# EAGLE design MainBoardR6 (EAGLE 6.5.0)
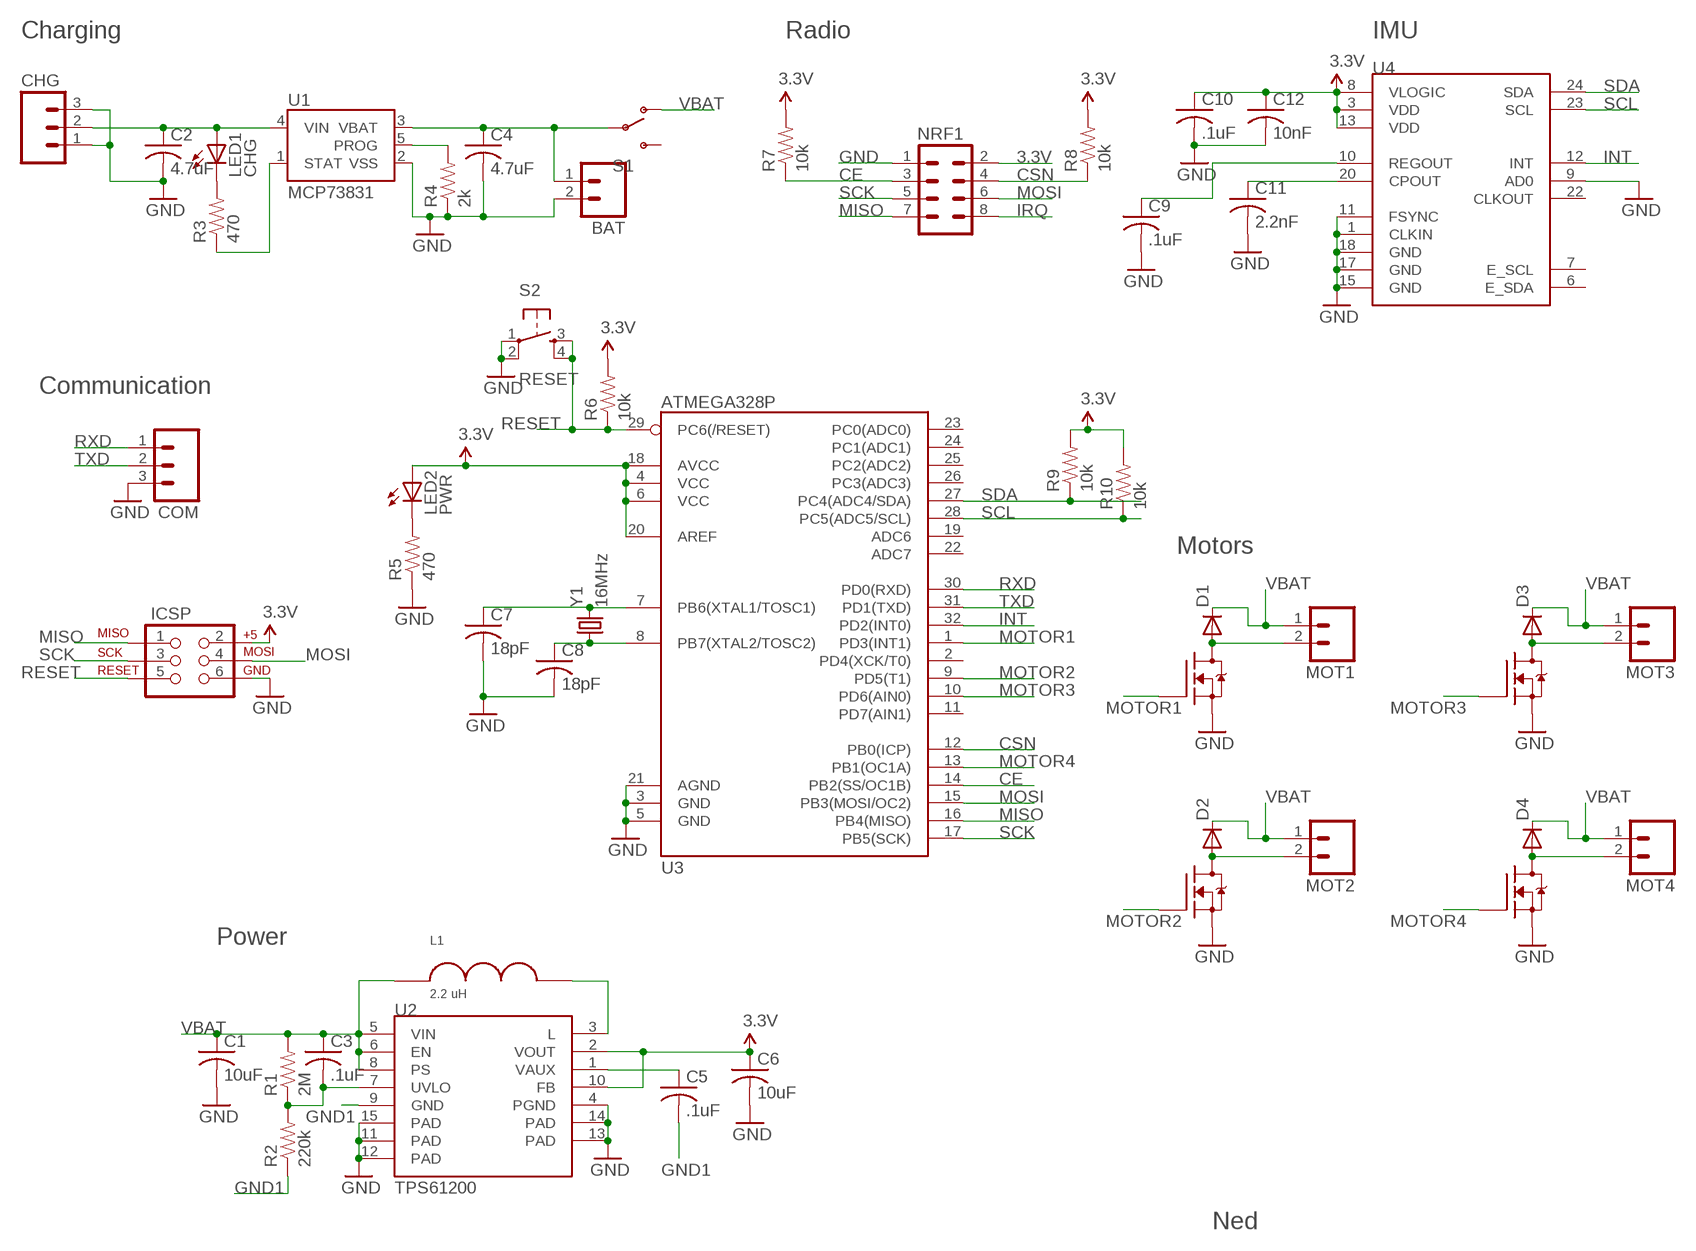
[diagram p0: schematic, sheet 1]

## Parts
BAT  M02LOCK_LONGPADS  [1X02_LOCK_LONGPADS]
C1  10uF  C-USC0805  [C0805]
C2  4.7uF  C-USC0805  [C0805]
C3  .1uF  C-USC0805  [C0805]
C4  4.7uF  C-USC0805  [C0805]
C5  .1uF  C-USC0805  [C0805]
C6  10uF  C-USC0805  [C0805]
C7  18pF  C-USC0805  [C0805]
C8  18pF  C-USC0805  [C0805]
C9  .1uF  C-USC0805  [C0805]
C10  .1uF  C-USC0805  [C0805]
C11  2.2nF  C-USC0805  [C0805]
C12  10nF  C-USC0805  [C0805]
CHG  M03LONGPADS  [1X03_LONGPADS]
COM  M03LONGPADS  [1X03_LONGPADS]
D1  BAS16-V-GS18  [SOT23]
D2  BAS16-V-GS18  [SOT23]
D3  BAS16-V-GS18  [SOT23]
D4  BAS16-V-GS18  [SOT23]
ICSP  AVR_SPI_PRG_62X3_LOCK  [2X3_LOCK]
L1  2.2 uH  BRHL2518T2R2M  [2518]
LED1  CHG  LED1206  [LED-1206]
LED2  PWR  LED1206  [LED-1206]
MOT1  M02LOCK_LONGPADS  [1X02_LOCK_LONGPADS]
MOT2  M02LOCK_LONGPADS  [1X02_LOCK_LONGPADS]
MOT3  M02LOCK_LONGPADS  [1X02_LOCK_LONGPADS]
MOT4  M02LOCK_LONGPADS  [1X02_LOCK_LONGPADS]
NRF1  M04X2  [2X4]
R1  2M  RESISTOR0805-RES  [0805]
R2  220k  RESISTOR0805-RES  [0805]
R3  470  RESISTOR0805-RES  [0805]
R4  2k  RESISTOR0805-RES  [0805]
R5  470  RESISTOR0805-RES  [0805]
R6  10k  RESISTOR0805-RES  [0805]
R7  10k  RESISTOR0805-RES  [0805]
R8  10k  RESISTOR0805-RES  [0805]
R9  10k  RESISTOR0805-RES  [0805]
R10  10k  RESISTOR0805-RES  [0805]
S1  SWITCH-SPST-SMD-A  [SWITCH-SPST-SMD-A]
S2  RESET  TAC_SWITCHSMD  [TACTILE_SWITCH_SMD]
T1  SI1902CDL  [SOT363_INFINEON]
T2  SI1902CDL  [SOT363_INFINEON]
U1  MCP73831  [SOT23-5]
U2  TPS61200  [QFN-10_PAD]
U3  ATMEGA328P  ATMEGA328_SMT  [TQFP32-08]
U4  MPU-9150QFN-24-NP  [QFN-24-NP]
Y1  16MHz  CRYSTAL5X3  [CRYSTAL-SMD-5X3]

## Nets
3.3V: C6.1 C10.1 C12.1 ICSP.2 LED2.A NRF1.2 R6.2 R7.2 R8.2 R9.2 R10.2 U2.2(VOUT) U2.10(FB) U3.4(VCC) U3.6(VCC) U3.18(AVCC) U3.20(AREF) U4.3(VDD) U4.8(VLOGIC) U4.13(VDD)
BAT+: BAT.1 C4.1 S1.2(P) U1.3(VBAT)
CE: NRF1.3 R7.1 U3.14(PB2(SS/OC1B))
CSN: NRF1.4 R8.1 U3.12(PB0(ICP))
GND: BAT.2 C1.2 C2.2 C4.2 C6.2 C7.2 C8.2 C9.2 C10.2 C11.2 C12.2 CHG.1 CHG.3 COM.3 ICSP.6 NRF1.1 R4.1 R5.1 S2.1 S2.2 T1.1(S) T1.4(S) T2.1(S) T2.4(S) U1.2(VSS) U2.4(PGND) U2.11(PAD) U2.12(PAD) U2.13(PAD) U2.14(PAD) U2.15(PAD) U3.3(GND) U3.5(GND) U3.21(AGND) U4.1(CLKIN) U4.9(AD0) U4.11(FSYNC) U4.15(GND) U4.17(GND) U4.18(GND)
GND1: C5.2 R2.1 U2.9(GND)
INT: U3.32(PD2(INT0)) U4.12(INT)
IRQ: NRF1.8
MISO: ICSP.1 NRF1.7 U3.16(PB4(MISO))
MOSI: ICSP.4 NRF1.6 U3.15(PB3(MOSI/OC2))
MOT1-: D1.1(A) MOT1.2 T1.6(D)
MOT2-: D2.1(A) MOT2.2 T1.3(D)
MOT3-: D3.1(A) MOT3.2 T2.6(D)
MOT4-: D4.1(A) MOT4.2 T2.3(D)
MOTOR1: T1.2(G) U3.1(PD3(INT1))
MOTOR2: T1.5(G) U3.9(PD5(T1))
MOTOR3: T2.2(G) U3.10(PD6(AIN0))
MOTOR4: T2.5(G) U3.13(PB1(OC1A))
N$2: C7.1 U3.7(PB6(XTAL1/TOSC1)) Y1.3
N$3: C8.1 U3.8(PB7(XTAL2/TOSC2)) Y1.1
N$4: C11.1 U4.20(CPOUT)
N$5: LED1.C R3.2
N$9: C9.1 U4.10(REGOUT)
N$10: R3.1 U1.1(STAT)
N$12: R4.2 U1.5(PROG)
N$13: C5.1 U2.1(VAUX)
N$14: C3.2 R1.1 R2.2 U2.7(UVLO)
N$15: LED2.C R5.2
N$16: L1.P$2 U2.3(L)
RESET: ICSP.5 R6.1 S2.3 S2.4 U3.29(PC6(/RESET))
RXD: COM.1 U3.30(PD0(RXD))
SCK: ICSP.3 NRF1.5 U3.17(PB5(SCK))
SCL: R10.1 U3.28(PC5(ADC5/SCL)) U4.23(SCL)
SDA: R9.1 U3.27(PC4(ADC4/SDA)) U4.24(SDA)
TXD: COM.2 U3.31(PD1(TXD))
VBAT: C1.1 C3.1 D1.3(C) D2.3(C) D3.3(C) D4.3(C) L1.P$1 MOT1.1 MOT2.1 MOT3.1 MOT4.1 R1.2 S1.1(O) U2.5(VIN) U2.6(EN) U2.8(PS)
VIN: C2.1 CHG.2 LED1.A U1.4(VIN)
Unconnected: S1.3(S) U3.2(PD4(XCK/T0)) U3.11(PD7(AIN1)) U3.19(ADC6) U3.22(ADC7) U3.23(PC0(ADC0)) U3.24(PC1(ADC1)) U3.25(PC2(ADC2)) U3.26(PC3(ADC3)) U4.6(E_SDA) U4.7(E_SCL) U4.22(CLKOUT)

## Notes on the sheet
- Charging | Radio | IMU
- Communication
- Motors
- Power
- Ned

## Library data of the parts
BAT MOT1-MOT4 = SparkFun:M02: Header 2 Standard 2-pin 0.1" header. Use with straight break away headers (SKU : PRT-00116), right angle break away headers (PRT-00553), swiss pins (PRT-00743), machine pins (PRT-00117), and female headers (PRT-00115). Molex polarized connector foot print use with SKU : PRT-08233 with associated crimp pins and housings.
C1-C12 = rcl:C-US: CAPACITOR, American symbol
CHG COM = SparkFun:M03: Header 3 Standard 3-pin 0.1" header. Use with straight break away headers (SKU : PRT-00116), right angle break away headers (PRT-00553), swiss pins (PRT-00743), machine pins (PRT-00117), and female headers (PRT-00115). Molex polarized connector foot print use with SKU : PRT-08232 with associated crimp pins and housings.
D1-D4 = diode:BAS16-V-GS18
ICSP = SparkFun:AVR_SPI_PRG_6: AVR ISP 6 Pin This is the reduced ISP connector for AVR programming. Common on Arduino. This footprint will take up less PCB space and can be used with a 10-pin to 6-pin adapter such as SKU: BOB-08508
L1 = inductors:BRHL2518T2R2M
LED1 LED2 = SparkFun:LED: LEDs Standard schematic elements and footprints for 5mm, 3mm, 1206, and 0603 sized LEDs. 5mm - Spark Fun Electronics SKU : COM-00529 (and others)
NRF1 = SparkFun:M04X2
R1-R10 = SparkFun:RESISTOR: Resistor Basic schematic elements and footprints for 0603, 1206, and PTH resistors.
S1 = SparkFun:SWITCH-SPST: SPST Switch Simple slide switch. Spark Fun Electronics SKU : COM-00102
S2 = SparkFun:TAC_SWITCH: Momentary Switch Button commonly used for reset or general input. Spark Fun Electronics SKU : COM-00097
T1 T2 = transistor-fet:SI1902CDL
U1 = SparkFun:MCP73831: Microchip's MCP73831 Miniature single cell, fully integrated Li-Ion, Li-polymer charge management controller http://ww1.microchip.com/downloads/en/DeviceDoc/21984a.pdf
U2 = SparkFun:TPS61200: DC to DC Booster
U3 = SparkFun-DigitalIC:ATMEGA328_SMT: 32-Pin Atmega328 part Commonly used on Arduino compatible boards Available in QFP and QFN packages TQFP is IC-09069 QFN is non-stock; PROD_ID: IC-09069
U4 = SparkFun-Sensors:MPU-9150: 9DOF (3mag, 3accel, 3rotat). I2C interface.
Y1 = SparkFun:CRYSTAL: Crystals Various standard crystals. Proven footprints. Spark Fun Electronics SKU : COM-00534

## Board
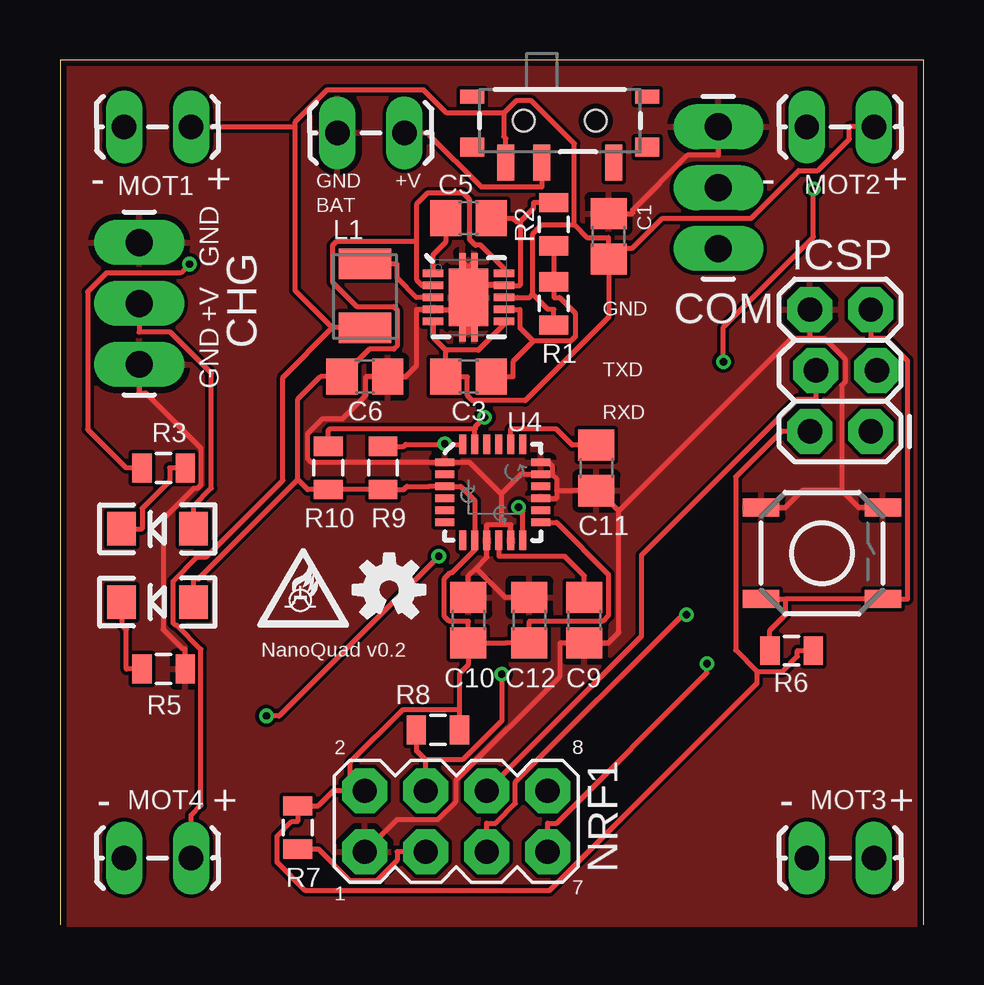
[diagram p1: board, top side]
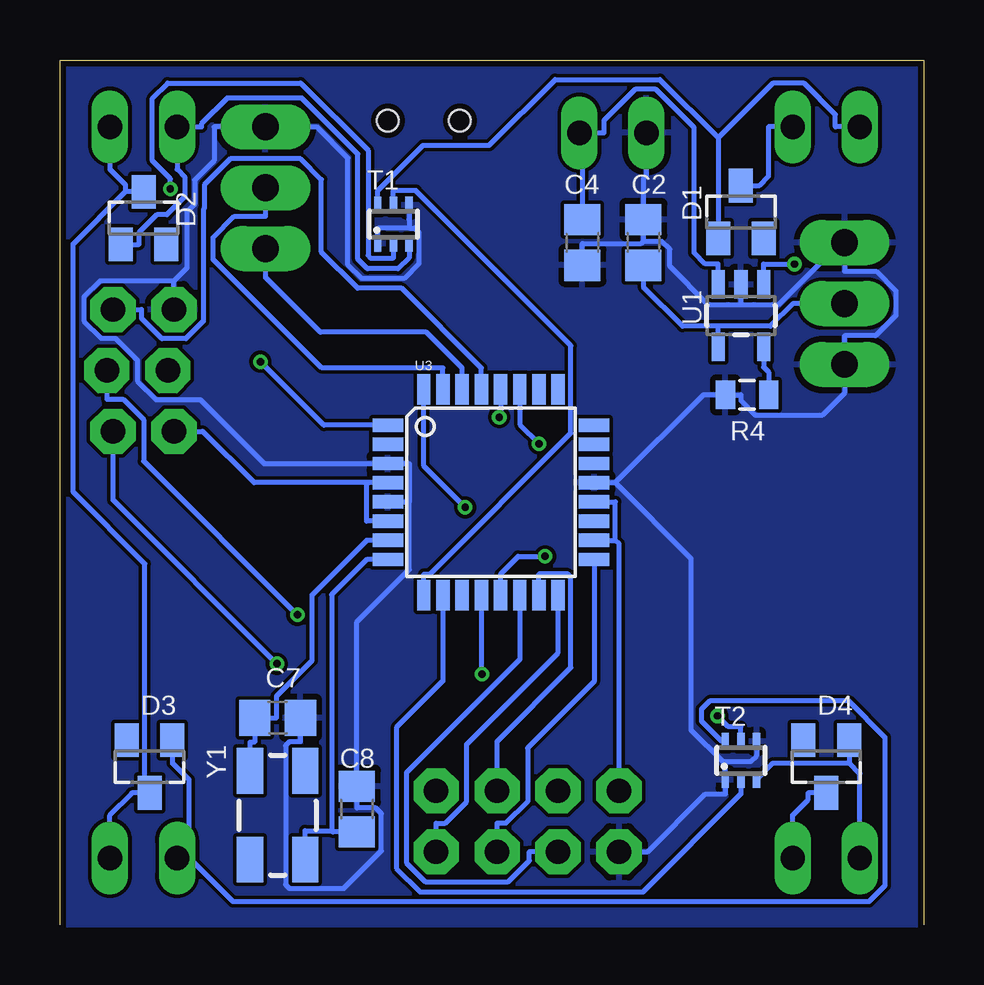
[diagram p2: board, bottom side, seen from below]

Size 35.99 x 36.06 mm. Coordinates in mm from the lower left corner, seen from the top.
Outline: 35.99,0 35.99,36.06 0,36.06 0,0
Copper layers (1*2*15*16): Top 0.035mm / dielectric 0.2mm / layer 2 0.0175mm / dielectric 1.1mm / layer 15 0.0175mm / dielectric 0.2mm / Bottom 0.035mm
Design rules "SeeedStudio_DRU_no_angle_20130527": minimum track width 6mil, minimum drill 12mil, track to track 6mil, track to pad 6mil, pad to pad 6mil, via to via 6mil, smd to smd 0mil, copper to edge 10mil, drill to drill 10mil, minimum pad ring 6mil, minimum via ring 6mil, stop-mask expansion 2mil, vias tented up to drill 25mil, thermal gap 10mil

### Footprints (pad centres in the part's own frame; a part is rotated, then mirrored left to right if it is on the bottom)
1X02_LOCK_LONGPADS = drill 1.016 long: 1 -0.127,0; 2 2.667,0
C0805 = smd 1.3 x 1.5: 1 -0.95,0; 2 0.95,0
1X03_LONGPADS = drill 1.118 pad 1.88 long: 1 0,0; 2 2.54,0; 3 5.08,0
SOT23 = smd 1 x 1.4: 1 -0.95,-1.1; 2 0.95,-1.1; 3 0,1.1
2X3_LOCK = drill 1.016 pad 1.88 octagon: 1 0,0; 2 0,2.54; 3 2.54,-0.254; 4 2.54,2.286; 5 5.08,0; 6 5.08,2.54
2518 = smd 1.27 x 2.184: P$1 -0.254,0; P$2 2.413,0
LED-1206 = smd 1.2 x 1.4: A -1.5,0; C 1.5,0
2X4 = drill 1.016 pad 1.88 octagon: 1 -3.81,-1.27; 2 -3.81,1.27; 3 -1.27,-1.27; 4 -1.27,1.27; 5 1.27,-1.27; 6 1.27,1.27; 7 3.81,-1.27; 8 3.81,1.27
0805 = smd 0.8 x 1.2: 1 -0.9,0; 2 0.9,0
SWITCH-SPST-SMD-A = smd 0.7 x 1.5: 1 -2.25,-1.75; 2 -0.75,-1.75; 3 2.25,-1.75 | smd 1 x 0.6: GND1 -3.65,1; GND3 3.65,1 | smd 1 x 0.8: GND2 -3.65,-1.1; GND4 3.65,-1.1 | hole 0.9: -1.5,0; 1.5,0
TACTILE_SWITCH_SMD = smd 1.524 x 0.762: 1 -2.54,1.905; 2 2.54,1.905; 3 -2.54,-1.905; 4 2.54,-1.905
SOT363_INFINEON = smd 0.3 x 0.7: 1 -0.65,-0.8; 2 0,-0.8; 3 0.65,-0.8; 4 0.65,0.8; 5 0,0.8; 6 -0.65,0.8
SOT23-5 = smd 0.55 x 1.2: 1 -0.95,-1.3; 2 0,-1.3; 3 0.95,-1.3; 4 0.95,1.3; 5 -0.95,1.3
QFN-10_PAD = smd 0.297 x 0.85: 1 -1,-1.475; 2 -0.5,-1.475; 3 0,-1.475; 4 0.5,-1.475; 5 1,-1.475; 6 1,1.475; 7 0.5,1.475; 8 0,1.475; 9 -0.5,1.475; 10 -1,1.475 | smd 0.7 x 0.28: 11 -1.5,0.25; 12 -1.5,-0.25; 13 1.5,0.25; 14 1.5,-0.25 | smd 2.4 x 1.65: 15 0,0
TQFP32-08 = smd 1.27 x 0.559: 1 -4.293,2.8; 2 -4.293,2; 3 -4.293,1.2; 4 -4.293,0.4; 5 -4.293,-0.4; 6 -4.293,-1.2; 7 -4.293,-2; 8 -4.293,-2.8; 17 4.293,-2.8; 18 4.293,-2; 19 4.293,-1.2; 20 4.293,-0.4; 21 4.293,0.4; 22 4.293,1.2; 23 4.293,2; 24 4.293,2.8 | smd 0.559 x 1.27: 9 -2.8,-4.293; 10 -2,-4.293; 11 -1.2,-4.293; 12 -0.4,-4.293; 13 0.4,-4.293; 14 1.2,-4.293; 15 2,-4.293; 16 2.8,-4.293; 25 2.8,4.293; 26 2,4.293; 27 1.2,4.293; 28 0.4,4.293; 29 -0.4,4.293; 30 -1.2,4.293; 31 -2,4.293; 32 -2.8,4.293
QFN-24-NP = smd 0.8 x 0.3: 1 -2,1.25; 2 -2,0.75; 3 -2,0.25; 4 -2,-0.25; 5 -2,-0.75; 6 -2,-1.25; 13 2,-1.25; 14 2,-0.75; 15 2,-0.25; 16 2,0.25; 17 2,0.75; 18 2,1.25 | smd 0.3 x 0.8: 7 -1.25,-2; 8 -0.75,-2; 9 -0.25,-2; 10 0.25,-2; 11 0.75,-2; 12 1.25,-2; 19 1.25,2; 20 0.75,2; 21 0.25,2; 22 -0.25,2; 23 -0.75,2; 24 -1.25,2
CRYSTAL-SMD-5X3 = smd 1.9 x 1.1: 1 -1.85,-1.15; 2 1.85,-1.15; 3 1.85,1.15; 4 -1.85,1.15

### Placement (x,y rotation side)
BAT  14.22,33.02 180 top
C1  22.86,28.7 90 top
C2  11.68,28.45 90 bottom
C3  17.02,22.86 0 top
C4  14.22,28.45 270 bottom
C5  17.02,29.46 0 top
C6  12.7,22.86 0 top
C7  26.92,8.64 0 bottom
C8  23.62,4.83 90 bottom
C9  21.84,12.7 270 top
C10  17.02,12.7 90 top
C11  22.35,19.05 270 top
C12  19.56,12.7 90 top
CHG  3.3,23.37 90 top
COM  27.43,28.19 90 top
D1  7.62,29.72 0 bottom
D2  32.51,29.46 0 bottom
D3  32.26,6.6 180 bottom
D4  4.06,6.6 180 bottom
ICSP  33.78,20.57 90 top
L1  12.7,25.15 90 top
LED1  4.06,16.51 180 top
LED2  4.06,13.46 180 top
MOT1  5.33,33.27 180 top
MOT2  33.78,33.27 180 top
MOT3  33.78,2.79 180 top
MOT4  5.33,2.79 180 top
NRF1  16.51,4.32 0 top
R1  20.57,25.91 270 top
R2  20.57,29.21 270 top
R3  4.32,19.05 0 top
R4  7.37,22.1 0 bottom
R5  4.32,10.67 180 top
R6  30.48,11.43 0 top
R7  9.91,4.06 90 top
R8  15.75,8.13 0 top
R9  13.46,19.05 270 top
R10  11.18,19.05 270 top
S1  20.83,33.53 0 top
S2  31.75,15.49 0 top
T1  22.1,29.21 0 bottom
T2  7.62,6.86 0 bottom
U1  7.62,25.4 180 bottom
U2  17.02,26.16 270 top
U3  18.03,18.03 0 bottom
U4  18.03,18.03 0 top
U$1  [BURNT_TRANSISTORS_XSM]  10.16,13.72 0 top
U$2  [OSHW-LOGO-S]  13.72,13.97 0 top
Y1  26.92,4.57 90 bottom

### Tracks (layer width: path | path; a pad name or v marks a point on that pad's centre or on a via)
3.3V
  Top 0.203: U4.13 20.69,16.78 22.85,14.62 22.85,12.9 22.61,12.65 19.56,12.65 C12.1 18.55,11.75 18.02,11.75 C10.1 | 14.85,28.48 14.85,26.91 15.09,26.66 U2.2 | U2.10 18.49,27.38 17.54,28.33 17.3,28.33 17.06,28.57 17.06,30.24 16.8,30.5 15.3,30.5 14.85,30.04 14.85,28.48 | 14.85,28.48 11.51,28.48 11.35,28.33 11.35,26.8 12.37,25.78 13.9,25.78 14.05,25.63 14.05,24.14 13.91,24 12.89,24 C6.1 10.85,22.86 9.91,21.92 9.91,18.56 | 9.91,18.56 5.76,14.42 5.56,14.42 LED2.A | 9.91,18.56 10.32,18.15 R10.2 R9.2 14.32,18.15 14.45,18.28 15.38,18.28 U4.3 16.69,18.28 17.28,17.69 U4.8 17.28,15.62 16.35,14.69 16.27,14.69 16.01,14.44 16.01,12.87 16.23,12.65 17.02,12.65 C10.1 | 29.04,10.57 29.04,10.07 20.39,1.42 10.23,1.42 9.04,2.61 9.04,3.69 9.66,4.31 9.91,4.31 R7.2 10.33,4.96 10.76,4.96 11.38,5.59 12.1,5.59 | 29.04,10.57 30.11,10.57 30.73,11.19 30.73,11.43 R6.2 | 29.04,10.57 28.15,11.46 28.15,18.68 30.05,20.57 ICSP.2 | 16.65,8.98 16.65,10.48 17.02,10.85 C10.1 | R8.2 16.65,8.98 | 12.1,5.59 12.1,6.79 14.3,8.98 16.65,8.98 | NRF1.2 12.1,5.59
  Bottom 0.203: 12.85,16.03 12.85,17.63 U3.20 | 12.85,16.03 12.7,15.88 12.7,6.78 NRF1.2 | ICSP.2 30.05,20.57 27.91,18.43 23.22,18.43 | 23.22,18.43 23.11,18.43 U3.4 | U3.6 23.22,16.83 23.22,18.43 | U3.18 12.85,16.03
BAT+
  Top 0.203: S1.2 20.08,30.77 17.54,30.77 15.37,32.95 15.37,33.02 BAT.1
  Bottom 0.203: 13.91,33.02 14.22,32.71 C4.1 | 13.91,33.02 13.34,33.02 13.34,33.53 12.03,34.84 11.16,34.84 9.57,33.24 9.57,28.02 9.1,27.55 8.57,27.55 U1.3 | BAT.1 13.91,33.02
CE
  Top 0.203: R7.1 10.76,3.16 12.08,1.85 13.2,1.85 14.05,2.7 14.05,3.05 NRF1.3
  Bottom 0.203: NRF1.3 16.43,3.05 16.43,2.68 17.31,1.8 20.77,1.8 21.56,2.59 21.56,6.34 16.83,11.07 U3.14
CSN  (via drill 0.3 pad 0.61)
  Top 0.203: v18.41,10.45 18.41,8.51 16.78,6.88 15.24,6.88 | 15.24,6.88 14.85,7.27 R8.1 | 15.24,6.88 15.24,6.18 NRF1.4
  Bottom 0.203: v18.41,10.45 18.43,10.47 18.43,12.85 U3.12
GND
  Top 0.203: 20.69,18.1 20.69,17.78 U4.15 | 20.51,18.78 20.69,18.61 20.69,18.1 | 20.69,18.1 21.35,18.1 C11.2 22.43,18.1 23.28,17.25 | 20.51,18.78 20.51,19.14 20.36,19.28 U4.18 | 20.51,18.78 U4.17 19.38,18.78 19.2,18.78 18.38,17.97 | 18.38,17.97 18.38,16.69 | 18.38,17.97 17.07,19.28 U4.1 10.47,19.28 10.32,19.44 10.32,20.48 10.95,21.1 11.78,21.1 12.75,22.07 12.75,22.86 C6.2 14.4,22.86 14.86,23.32 14.86,25.66 U2.4 15.88,25.66 16.22,25.66 16.26,25.7 17.02,25.7 | 23.28,17.25 23.28,12.18 22.85,11.75 C9.2 20.84,11.75 20.84,10.37 16.51,6.04 16.51,5.16 15.74,4.39 14.05,4.39 NRF1.1 | 23.28,17.25 30.5,24.46 31.24,24.46 | 32.56,18.11 33.27,17.4 S2.2 | 31.24,24.46 31.84,24.46 32.72,23.58 32.72,22.64 32.56,22.49 32.56,18.11 | 32.56,18.11 30.94,18.11 30.23,17.4 S2.1 | ICSP.6 31.24,24.46 | 18.38,16.69 18.78,16.69 U4.11 | 18.38,16.69 17.78,16.69 U4.9 17.78,15.32 17.33,14.87 | C1.2 23.86,29.65 23.86,29.8 26.14,32.08 27.43,32.08 COM.3 | 17.33,14.87 17.02,14.55 C10.2 | 17.33,14.87 18.55,13.65 C12.2 | R5.1 5.22,11.52 5.09,11.52 4.3,12.31 4.3,16.93 5.56,18.2 5.72,18.2 5.87,18.34 5.87,19.87 3.57,22.17 3.3,22.17 CHG.1 | 17.02,27.41 U2.12 | 17.02,27.41 17.02,27.26 U2.15 17.02,26.06 17.02,25.7 | U2.11 17.02,27.41 | 17.02,25.7 17.02,25.43 | U2.13 17.27,25.27 17.19,25.27 17.02,25.43 | 17.02,25.43 17.02,24.71 16.81,24.71 U2.14
  Bottom 0.203: 21.45,29.05 21.22,29.05 21.03,28.87 21.03,27.57 21.65,26.95 23.43,26.95 23.99,27.51 23.99,31.97 25.3,33.27 COM.3 28.5,33.27 29.57,33.27 29.57,31.86 30.38,31.05 30.38,30.05 30.71,29.72 30.71,27.38 31.24,26.85 | 21.45,29.05 21.45,29.41 T1.4 | C4.2 14.22,28.4 11.78,28.4 11.68,28.49 | 7.62,25.85 8.97,25.85 10.58,27.45 10.58,28.16 10.91,28.49 11.68,28.49 | 7.62,25.85 7.62,25.95 U1.2 | 3.3,28.39 3.53,28.39 6.07,25.85 7.62,25.85 | 3.3,28.39 3.3,27.25 1.99,27.25 1.17,26.43 1.17,25.4 2,24.56 3.3,24.56 CHG.1 3.3,22.17 4.23,21.24 7,21.24 7.61,21.85 7.61,22.1 R4.1 8.92,22.1 9.19,22.1 12.85,18.43 | CHG.3 3.3,28.39 | 21.45,29.05 22.71,29.05 22.75,29.01 T1.1 | 21.44,17.63 21.54,17.63 U3.5 | 21.44,17.63 21.44,14.81 23.62,12.63 23.62,6.68 C8.2 23.62,4.87 22.83,4.87 22.6,4.64 22.6,3.08 24.16,1.52 26.43,1.52 26.59,1.68 26.59,7.48 26.44,7.63 25.97,7.63 C7.2 | 21.44,17.63 21.44,19.23 U3.3 27.49,19.23 30.15,21.89 31.99,21.89 32.77,22.67 32.77,23.54 33.68,24.46 34.28,24.46 34.99,25.17 34.99,26.18 34.32,26.85 31.24,26.85 | 11.68,28.49 C2.2 11.68,31.11 11.56,31.24 BAT.2 | 8.27,6.81 7.21,6.81 6.97,7.05 T2.4 | 12.85,18.43 9.7,15.28 9.7,8.13 8.38,6.81 8.27,6.81 | 8.27,6.81 8.27,6.36 T2.1 8.27,5.45 9.1,5.45 11.51,3.05 NRF1.1 | U3.21 12.85,18.43 | ICSP.6 31.24,26.85
  pour Top: 0,36.07 36.07,36.07 36.07,0 0,0
  pour Bottom: 0,36.07 36.07,36.07 36.07,0 0,0
GND1
  Top 0.203: R2.1 19.72,30.11 19.72,29.86 19.17,29.31 | 19.17,29.31 19.02,29.31 18.87,29.46 C5.2 | 19.17,29.31 19.17,26.66 U2.9
INT  (via drill 0.3 pad 0.61)
  Top 0.203: U4.12 19.28,17.23 v19.11,17.41
  Bottom 0.203: v19.11,17.41 20.83,19.13 U3.32
MISO  (via drill 0.3 pad 0.61)
  Top 0.203: NRF1.7 20.32,4.24 20.69,4.24 26.96,10.51 v26.96,10.89
  Bottom 0.203: v26.96,10.89 33.78,17.71 ICSP.1 | U3.16 15.23,11.35 19.05,7.53 19.05,5.14 19.95,4.24 20.32,4.24 NRF1.7
MOSI
  Top 0.203: NRF1.6 24.23,12.04 24.23,15.41 30.74,21.92 31.5,21.92 ICSP.4
  Bottom 0.203: NRF1.6 17.78,7.65 14.7,10.73 14.7,14.51 14.82,14.63 16.03,14.63 U3.15
MOT1-
  Bottom 0.203: 8.57,32.82 D1.1 | 8.57,32.82 6.3,35.09 4.99,35.09 3.68,33.78 3.68,33.27 MOT1.2 | 8.57,32.82 11,35.24 15.36,35.24 18.11,32.5 20.87,32.5 22.75,30.61 T1.6
MOT2-
  Bottom 0.203: T1.3 21.45,27.81 21.9,27.36 23.19,27.36 23.58,27.75 23.58,32.14 25.91,34.47 29.03,34.47 30.1,33.4 30.1,33.27 MOT2.2 31.11,31.5 30.79,31.17 30.79,30.36 31.54,29.61 31.95,29.61 32.71,28.85 32.71,28.36 D2.1
MOT3-
  Bottom 0.203: T2.6 8.43,7.66 9.25,8.49 9.25,9 8.89,9.36 3.15,9.36 1.62,7.83 1.62,1.64 2.29,0.97 28.78,0.97 30.61,2.79 | D3.1 31.31,6.75 30.61,6.05 30.61,2.79 | MOT3.2 30.61,2.79
MOT4-
  Bottom 0.203: T2.3 6.28,6.75 3.11,6.75 | D4.1 3.11,6.75 | MOT4.2 2.67,6.3 3.11,6.75
MOTOR1  (via drill 0.3 pad 0.61)
  Top 0.203: v27.64,23.48 27.64,24.92 31.39,28.68 v31.39,30.68
  Bottom 0.203: v31.39,30.68 31.39,31.1 32.15,31.85 32.15,34.46 31.51,35.1 25.96,35.1 23.16,32.29 23.16,27.9 23.06,27.81 22.1,27.81 T1.2 | U3.1 25,20.83 v27.64,23.48
MOTOR2
  Bottom 0.203: T1.5 22.1,30.61 21.17,30.61 14.7,24.15 14.7,20.5 20.57,14.63 20.83,14.63 U3.9
MOTOR3
  Bottom 0.203: T2.2 7.62,5.45 11.7,1.38 20.99,1.38 21.97,2.36 21.97,8.23 20.03,10.17 U3.10
MOTOR4  (via drill 0.3 pad 0.61)
  Top 0.203: v15.78,15.37 9.13,8.71 v8.6,8.71
  Bottom 0.203: T2.5 7.62,8.26 8.15,8.26 v8.6,8.71 | U3.13 17.63,14.63 16.9,15.37 v15.78,15.37
N$2
  Bottom 0.203: Y1.3 28.07,7.63 27.88,7.63 27.87,7.63 C7.1 26.97,8.64 26.97,9.54 25.49,11.02 25.49,13.76 23.22,16.03 U3.7
N$3
  Bottom 0.203: 24.68,3.93 24.68,13.77 23.22,15.23 U3.8 | 24.68,3.93 24.63,3.88 C8.1 | 24.68,3.93 25.77,3.93 Y1.1
N$4
  Top 0.203: C11.1 21.35,20 20.66,20.69 18.78,20.69 U4.20
N$5
  Top 0.203: LED1.C 3.42,16.51 3.42,17.36 4.56,18.51 4.56,19.05 R3.2
N$9
  Top 0.203: C9.1 21.84,14.55 21.02,15.38 18.28,15.38 U4.10
N$10  (via drill 0.3 pad 0.61)
  Top 0.203: R3.1 2.76,19.05 1.15,20.66 1.15,26.39 1.94,27.18 5.02,27.18 v5.39,27.55
  Bottom 0.203: U1.1 6.67,27.55 v5.4,27.55 v5.39,27.55
N$12
  Bottom 0.203: U1.5 6.67,23.25 6.47,23.04 R4.2
N$13
  Top 0.203: C5.1 16.07,28.46 15.54,27.93 U2.1
N$14
  Top 0.203: U2.7 19.17,25.66 19.17,24.88 19.72,24.33 | 19.72,24.33 18.87,23.48 18.87,22.86 C3.2 | 19.72,24.33 21.27,24.33 21.47,24.53 21.47,25.5 20.82,26.15 20.57,26.15 R1.1 R2.2
N$15
  Top 0.203: LED2.C 2.56,12.51 2.76,12.31 2.76,10.67 R5.2
N$16
  Top 0.203: U2.3 14.86,26.16 14.05,26.98 14.05,27.56 L1.P$2
N$17
  Top 0.254: 18.29,26.67 17.53,26.67
RESET
  Top 0.203: ICSP.5 33.78,24.46 34.38,24.46 35.31,23.53 35.31,13.59 S2.4 30.23,13.59 | R6.1 29.58,12.28 30.23,12.93 30.23,13.59 | S2.3 30.23,13.59
  Bottom 0.203: U3.29 18.43,23.22 21.76,26.54 23.59,26.54 25.11,28.05 25.11,31.08 25.97,31.94 28.89,31.94 29.97,30.86 29.97,29.89 30.02,29.84 30.02,25.17 30.75,24.44 31.74,24.44 32.59,25.28 32.59,25.65 ICSP.5
RXD
  Bottom 0.203: COM.1 27.43,27 25.14,24.71 20.73,24.71 19.23,23.22 U3.30
SCK  (via drill 0.3 pad 0.61)
  Top 0.203: v26.1,12.93 25.94,12.93 18.97,5.96 18.97,5.06 18.15,4.24 17.78,4.24 NRF1.5
  Bottom 0.203: NRF1.5 17.78,4.24 17.41,4.24 16.51,5.14 16.51,7.38 13.74,10.15 U3.17 | v26.1,12.93 32.51,19.34 32.51,21.07 33.37,21.92 34.04,21.92 ICSP.3
SCL  (via drill 0.3 pad 0.61)
  Top 0.203: U4.23 17.28,20.69 17.3,20.69 | 17.3,20.69 17.3,20.78 v17.69,21.17 | 17.3,20.69 11.26,20.69 11.18,20.6 R10.1
  Bottom 0.203: v17.69,21.17 17.69,21.38 17.63,21.44 U3.28
SDA  (via drill 0.3 pad 0.61)
  Top 0.203: 16.03,20.03 v16.03,20.06 | 16.03,20.03 U4.24 | 16.03,20.03 14.4,20.03 14.32,19.95 R9.1
  Bottom 0.203: U3.27 16.83,20.86 v16.03,20.06
TXD
  Bottom 0.203: COM.2 27.43,29.54 28.73,29.54 29.61,28.66 29.61,27.74 25.09,23.22 20.03,23.22 U3.31
VBAT
  Top 0.203: 21.43,29.18 21.43,32.57 19.64,34.36 19,34.36 18.49,33.84 | 19.71,26.3 19.71,28.82 20.08,29.18 21.43,29.18 | 21.43,29.18 21.96,28.66 22.86,28.66 22.86,28.2 | MOT2.1 32.89,33.27 32.89,32.77 31.57,31.45 30.78,31.45 28.8,29.46 25.1,29.46 23.84,28.2 22.86,28.2 | 22.86,28.2 C1.1 22.86,25.33 19.38,21.86 17.18,21.86 16.97,22.07 16.97,22.86 C3.1 16.07,23.86 16.07,23.96 | 18.49,33.84 18.49,32.87 18.58,32.78 S1.1 | 18.49,33.84 16.12,33.84 15.16,34.8 11.12,34.8 9.78,33.46 9.78,33.27 | 9.78,33.27 9.78,26.46 11.35,24.89 | 9.78,33.27 6.48,33.27 MOT1.1 | MOT4.1 5.46,4.57 5.87,4.99 5.87,11.49 4.88,12.49 4.81,12.49 4.71,12.59 4.71,14.32 5.73,15.34 6.1,15.34 9.29,18.53 9.29,22.83 11.35,24.89 | U2.8 18.73,26.16 18.93,26.16 19.07,26.16 19.57,26.16 19.71,26.3 | 19.71,26.3 20.34,25.66 20.57,25.66 R1.2 | U2.6 18.49,25.02 17.44,23.96 16.07,23.96 | U2.5 15.54,24.49 16.07,23.96 | L1.P$1 11.35,24.89
  Bottom 0.203: D4.3 4.82,5.5 4.82,5.21 5.46,4.57 MOT4.1 | 32.45,5.5 32.45,15.06 35.44,18.05 35.44,28.39 33.27,30.56 | D3.3 32.45,5.5 | 32.45,5.5 32.46,5.5 33.01,5.5 33.01,5.47 33.91,4.57 MOT3.1 | D2.3 33.27,30.56 | MOT2.1 33.91,31.5 33.27,30.85 33.27,30.56 | D1.3 6.87,30.82 6.48,31.21 6.48,33.27 MOT1.1
VIN
  Top 0.203: LED1.A 5.56,17.46 5.57,17.46 6.31,18.21 6.31,23.01 4.6,24.71 3.3,24.71 CHG.2
  Bottom 0.203: CHG.2 5.44,25.91 6.39,24.95 8.57,24.95 | C2.1 11.68,26.59 10.04,24.95 8.57,24.95 | U1.4 8.57,24.95

### Text on the board
tPlace: GND | +V | - | + | - | + | GND | +V | GND | TXD | GND | RXD | NanoQuad v0.2 | 2 | 8 | - | + | - | + | 1 | 7